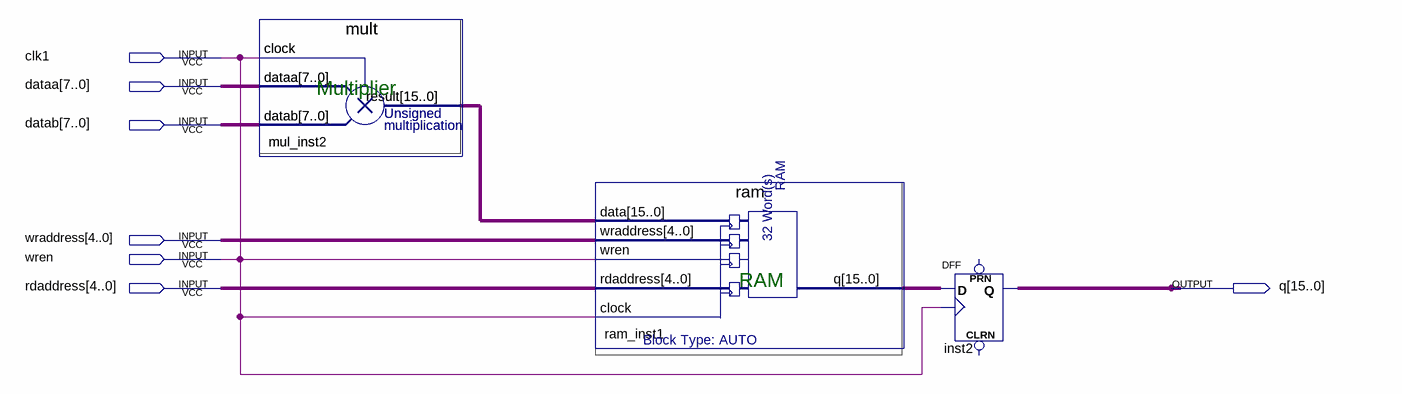
[diagram p0: schematic sheet]
// Quartus schematic pipemult.bdf as structural Verilog: 4 symbols, 7 pins
module pipemult (
  input  clk1,
  input  [7:0] dataa,
  input  [7:0] datab,
  input  [4:0] wraddress,
  input  wren,
  input  [4:0] rdaddress,
  output [15:0] q
);

  wire [15:0] mul_inst_result, ram_inst1_q;

  mult mul_inst (.clock(clk1), .dataa(dataa), .datab(datab), .result(mul_inst_result));
  mult mul_inst2 (.clock(clk1), .dataa(dataa), .datab(datab), .result(mul_inst_result));
  ram ram_inst1 (
    .data(mul_inst_result), .wraddress(wraddress), .wren(clk1), .rdaddress(rdaddress), .clock(clk1),
    .q(ram_inst1_q));
  DFF inst2[15:0] (.CLK(clk1), .D(ram_inst1_q), .Q(q));  // open: CLRN, PRN

  assign wren = clk1;

  // Notes on the sheet:
  //   Multiplier
  //   RAM
endmodule
